# Altium project EVB-ANNA-B5x5_Certifi.PrjPcb (part 1 of 2)
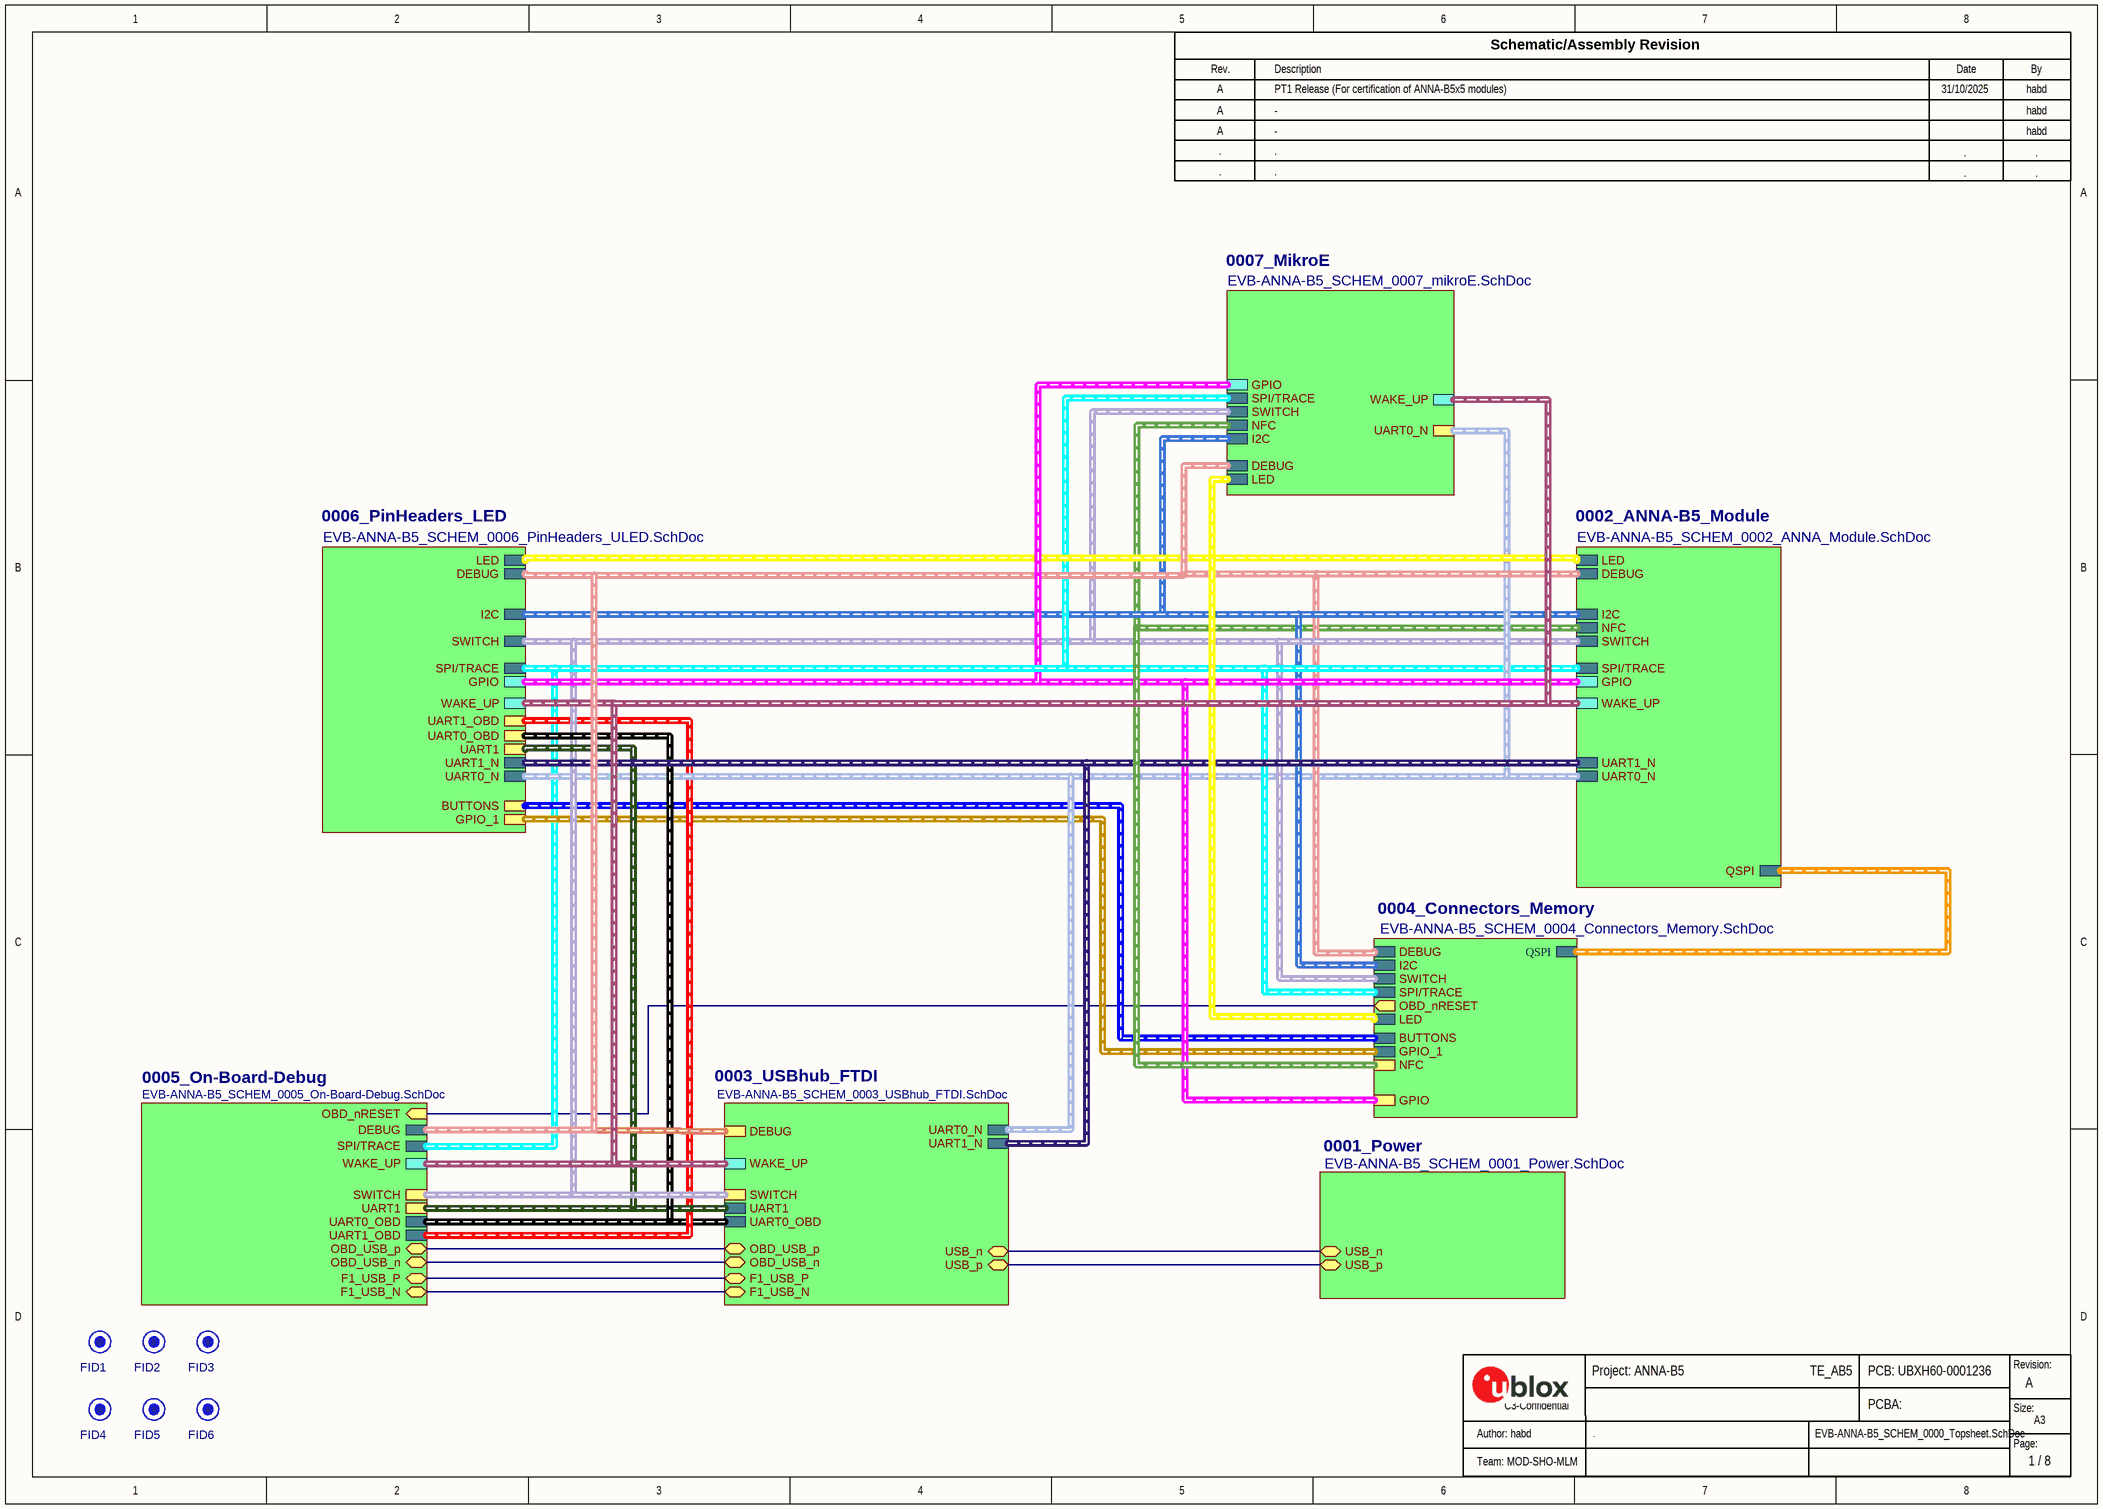
[diagram p0: EVB-ANNA-B5_SCHEM_0000_Topsheet.SchDoc]
GlobalClientName: u-blox; GlobalProjectCode: TE_AB5; GlobalProjectLink: www.u-blox.com; GlobalProjectName: ANNA-B5; GlobalProjectRevision: Rev A; GlobalProjectTeam: MOD-SHO-MLM; GlobalReleaseDate: 31/10/2025; PCBConfidentialGrade: C3-Confidential; PCBDocNum: UBXH60-0001236; PCBName: EVK-ANNA-B5x5; PCBRevRelease1: A; PCBRevReleaseBy1: habd; PCBRevReleaseBy2: -; PCBRevReleaseBy3: -; PCBRevReleaseBy4: -; PCBRevReleaseBy5: -; PCBRevReleaseDate1: 31/10/2025; PCBRevReleaseDate4: -; PCBRevReleaseDate5: -; PCBRevReleaseDesc1: PT1 Release (For certification of ANNA-B5x5 modules); PCBRevReleaseDesc2: -; PCBRevReleaseDesc3: -; PCBRevReleaseDesc4: -; PCBRevReleaseDesc5: -; PCBRevReleaseRev1: A; PCBRevReleaseRev2: -; PCBRevReleaseRev3: -; PCBRevReleaseRev4: -; PCBRevReleaseRev5: -; PCBUBXNum: UBXH60-0001236; ProjectEngineer: habd; ReleaseBy4: .; ReleaseBy4: .; ReleaseBy5: .; ReleaseBy5: .; ReleaseDate4: .; ReleaseDate5: .; ReleaseDesc4: .; ReleaseDesc5: .; ReleaseRev1: A; ReleaseRev2: -; ReleaseRev3: -; ReleaseRev4: .; ReleaseRev5: .; SchDocNum: EVK-ANNA-B5_SCHEM; SchSheetTotal: 8; SheetSize: A3; VariantBy1: habd; VariantBy2: habd; VariantBy3: habd; VariantBy4: .; VariantBy5: .; VariantDate1: 31/10/2025; VariantDate4: .; VariantDate5: .; VariantDesc1: PT1 Release (For certification of ANNA-B5x5 modules); VariantDesc2: -; VariantDesc3: -; VariantDesc4: .; VariantDesc5: .; VariantDescription: .; VariantRev: A; VariantRev1: A; VariantRev2: A; VariantRev3: A; VariantRev4: .; VariantRev5: .
5 sheets, 211 parts. Net scope: flat (ports and power ports of the same name join across sheets).
Board file: EVB-ANNA-B5x5_Certifi.PcbDoc
Sheets:
  EVB-ANNA-B5_SCHEM_0000_Topsheet.SchDoc
    0001_Power = EVB-ANNA-B5_SCHEM_0001_Power.SchDoc
    0002_ANNA-B5_Module = EVB-ANNA-B5_SCHEM_0002_ANNA_Module.SchDoc
    0003_USBhub_FTDI = EVB-ANNA-B5_SCHEM_0003_USBhub_FTDI.SchDoc
    0004_Connectors_Memory = EVB-ANNA-B5_SCHEM_0004_Connectors_Memory.SchDoc

## Sheet EVB-ANNA-B5_SCHEM_0000_Topsheet.SchDoc
size A3; Date: 7/24/2020; CompanyName: U-Blox; DrawnBy: EMOO; Engineer: EMOO; Organization: U-Blox; Address1: 3950 Fairview Industrial Dr SE #100; Address2: Salem, OR 97302; DocumentNumber: 1; SheetNumber: 1; SheetTotal: 8; SheetSize: B; SheetTitle: TopSheet

### Parts
FID1  FID  [FIDUCIAL40]  (value not drawn)  (no BOM)
FID2  FID  [FIDUCIAL40]  (value not drawn)  (no BOM)
FID3  FID  [FIDUCIAL40]  (value not drawn)  (no BOM)
FID4  FID  [FIDUCIAL40]  (value not drawn)  (no BOM)
FID5  FID  [FIDUCIAL40]  (value not drawn)  (no BOM)
FID6  FID  [FIDUCIAL40]  (value not drawn)  (no BOM)

### Sub-sheets
0001_Power = EVB-ANNA-B5_SCHEM_0001_Power.SchDoc: USB_n (bidir), USB_p (bidir)
0002_ANNA-B5_Module = EVB-ANNA-B5_SCHEM_0002_ANNA_Module.SchDoc: LED (harness LED), DEBUG (harness DEBUG), UART1_N (harness UART1_N), I2C (harness I2C), NFC (harness NFC), SWITCH (harness SWITCH), UART0_N (harness UART0_N), QSPI (harness QSPI), SPI/TRACE (harness SPI/TRACE), GPIO (harness GPIO), WAKE_UP (harness WAKE_UP)
0003_USBhub_FTDI = EVB-ANNA-B5_SCHEM_0003_USBhub_FTDI.SchDoc: USB_n (bidir), USB_p (bidir), F1_USB_P (bidir), F1_USB_N (bidir), UART1 (harness UART1), UART0_N (harness UART0_N), UART1_N (harness UART1_N), UART0_OBD (harness UART0_OBD), DEBUG (harness DEBUG), OBD_USB_n (bidir), OBD_USB_p (bidir), SWITCH (harness SWITCH), WAKE_UP (harness WAKE_UP)
0004_Connectors_Memory = EVB-ANNA-B5_SCHEM_0004_Connectors_Memory.SchDoc: DEBUG (harness DEBUG), I2C (harness I2C), SWITCH (harness SWITCH), QSPI (harness QSPI), SPI/TRACE (harness SPI/TRACE), LED (harness LED), BUTTONS (harness BUTTONS), GPIO_1 (harness GP1O_1), OBD_nRESET (out), NFC (harness NFC), GPIO (harness GPIO)
0005_On-Board-Debug = EVB-ANNA-B5_SCHEM_0005_On-Board-Debug.SchDoc (file not in this document): F1_USB_P (bidir), F1_USB_N (bidir), UART0_OBD (harness UART0_OBD), UART1_OBD (harness UART1_OBD), DEBUG (harness DEBUG), SPI/TRACE (harness SPI/TRACE), OBD_nRESET (in), OBD_USB_p (bidir), OBD_USB_n (bidir), UART1 (harness UART1), SWITCH (harness SWITCH), WAKE_UP (harness WAKE_UP)
0006_PinHeaders_LED = EVB-ANNA-B5_SCHEM_0006_PinHeaders_ULED.SchDoc (file not in this document): I2C (harness I2C), LED (harness LED), SWITCH (harness SWITCH), SPI/TRACE (harness SPI/TRACE), GPIO (harness GPIO), DEBUG (harness DEBUG), UART0_N (harness UART0_N), UART1_N (harness UART1_N), BUTTONS (harness BUTTONS), GPIO_1 (harness GP1O_1), UART1 (harness UART1), UART0_OBD (harness UART0_OBD), UART1_OBD (harness UART1_OBD), WAKE_UP (harness WAKE_UP)
0007_MikroE = EVB-ANNA-B5_SCHEM_0007_mikroE.SchDoc (file not in this document): I2C (harness I2C), LED (harness LED), SWITCH (harness SWITCH), NFC (harness NFC), DEBUG (harness DEBUG), SPI/TRACE (harness SPI/TRACE), GPIO (harness GPIO), UART0_N (harness UART0_N), WAKE_UP (harness WAKE_UP)

### Nets
(unnamed): sheet 0001_Power/USB_n, sheet 0003_USBhub_FTDI/USB_n
(unnamed): sheet 0001_Power/USB_p, sheet 0003_USBhub_FTDI/USB_p
(unnamed): sheet 0003_USBhub_FTDI/F1_USB_P, sheet 0005_On-Board-Debug/F1_USB_P
(unnamed): sheet 0003_USBhub_FTDI/F1_USB_N, sheet 0005_On-Board-Debug/F1_USB_N
(unnamed): sheet 0003_USBhub_FTDI/OBD_USB_n, sheet 0005_On-Board-Debug/OBD_USB_n
(unnamed): sheet 0003_USBhub_FTDI/OBD_USB_p, sheet 0005_On-Board-Debug/OBD_USB_p
(unnamed): sheet 0005_On-Board-Debug/OBD_nRESET, sheet 0004_Connectors_Memory/OBD_nRESET

### Buses and harness runs
harness sheet 0002_ANNA-B5_Module/DEBUG = sheet 0003_USBhub_FTDI/DEBUG = sheet 0004_Connectors_Memory/DEBUG = sheet 0005_On-Board-Debug/DEBUG = sheet 0006_PinHeaders_LED/DEBUG = sheet 0007_MikroE/DEBUG
harness sheet 0002_ANNA-B5_Module/GPIO = sheet 0004_Connectors_Memory/GPIO = sheet 0006_PinHeaders_LED/GPIO = sheet 0007_MikroE/GPIO
harness sheet 0002_ANNA-B5_Module/I2C = sheet 0004_Connectors_Memory/I2C = sheet 0006_PinHeaders_LED/I2C = sheet 0007_MikroE/I2C
harness sheet 0002_ANNA-B5_Module/LED = sheet 0004_Connectors_Memory/LED = sheet 0006_PinHeaders_LED/LED = sheet 0007_MikroE/LED
harness sheet 0002_ANNA-B5_Module/NFC = sheet 0004_Connectors_Memory/NFC = sheet 0007_MikroE/NFC
harness sheet 0002_ANNA-B5_Module/QSPI = sheet 0004_Connectors_Memory/QSPI
harness sheet 0002_ANNA-B5_Module/SPI/TRACE = sheet 0004_Connectors_Memory/SPI/TRACE = sheet 0005_On-Board-Debug/SPI/TRACE = sheet 0006_PinHeaders_LED/SPI/TRACE = sheet 0007_MikroE/SPI/TRACE
harness sheet 0002_ANNA-B5_Module/SWITCH = sheet 0003_USBhub_FTDI/SWITCH = sheet 0004_Connectors_Memory/SWITCH = sheet 0005_On-Board-Debug/SWITCH = sheet 0006_PinHeaders_LED/SWITCH = sheet 0007_MikroE/SWITCH
harness sheet 0002_ANNA-B5_Module/UART0_N = sheet 0003_USBhub_FTDI/UART0_N = sheet 0006_PinHeaders_LED/UART0_N = sheet 0007_MikroE/UART0_N
harness sheet 0002_ANNA-B5_Module/UART1_N = sheet 0003_USBhub_FTDI/UART1_N = sheet 0006_PinHeaders_LED/UART1_N
harness sheet 0002_ANNA-B5_Module/WAKE_UP = sheet 0003_USBhub_FTDI/WAKE_UP = sheet 0005_On-Board-Debug/WAKE_UP = sheet 0006_PinHeaders_LED/WAKE_UP = sheet 0007_MikroE/WAKE_UP
harness sheet 0003_USBhub_FTDI/UART0_OBD = sheet 0005_On-Board-Debug/UART0_OBD = sheet 0006_PinHeaders_LED/UART0_OBD
harness sheet 0003_USBhub_FTDI/UART1 = sheet 0005_On-Board-Debug/UART1 = sheet 0006_PinHeaders_LED/UART1
harness sheet 0004_Connectors_Memory/BUTTONS = sheet 0006_PinHeaders_LED/BUTTONS
harness sheet 0004_Connectors_Memory/GPIO_1 = sheet 0006_PinHeaders_LED/GPIO_1
harness sheet 0005_On-Board-Debug/UART1_OBD = sheet 0006_PinHeaders_LED/UART1_OBD

### Notes on the sheet
- Rev.
- Description
- Schematic/Assembly Revision
- Date
- By
- Revision:
- C3-Confidential
- Page:
- Size:
- A3

### Library data of the parts
FID1-FID6 = FIDUCIAL.04: Fiducial, 0.040" inner Dia, 0.075" outer Dia; Added By: Jeremy D; Part Number: FIDUCIAL.04; Size: 0.040"; Height: 0; DNP: DNP; Added Date: 2/1/2015; Checked By: Paul B; Checked Date: 2/5/2015

## Sheet EVB-ANNA-B5_SCHEM_0001_Power.SchDoc
size A3; Date: 7/24/2020; CompanyName: U-blox; DrawnBy: EMOO; Engineer: EMOO; Organization: U-blox; Address1: 3950 Fairview Industrial Dr SE #100; Address2: Salem, OR 97302; DocumentNumber: 2; SheetNumber: 2; SheetTotal: 8; SheetSize: B; SheetTitle: Power
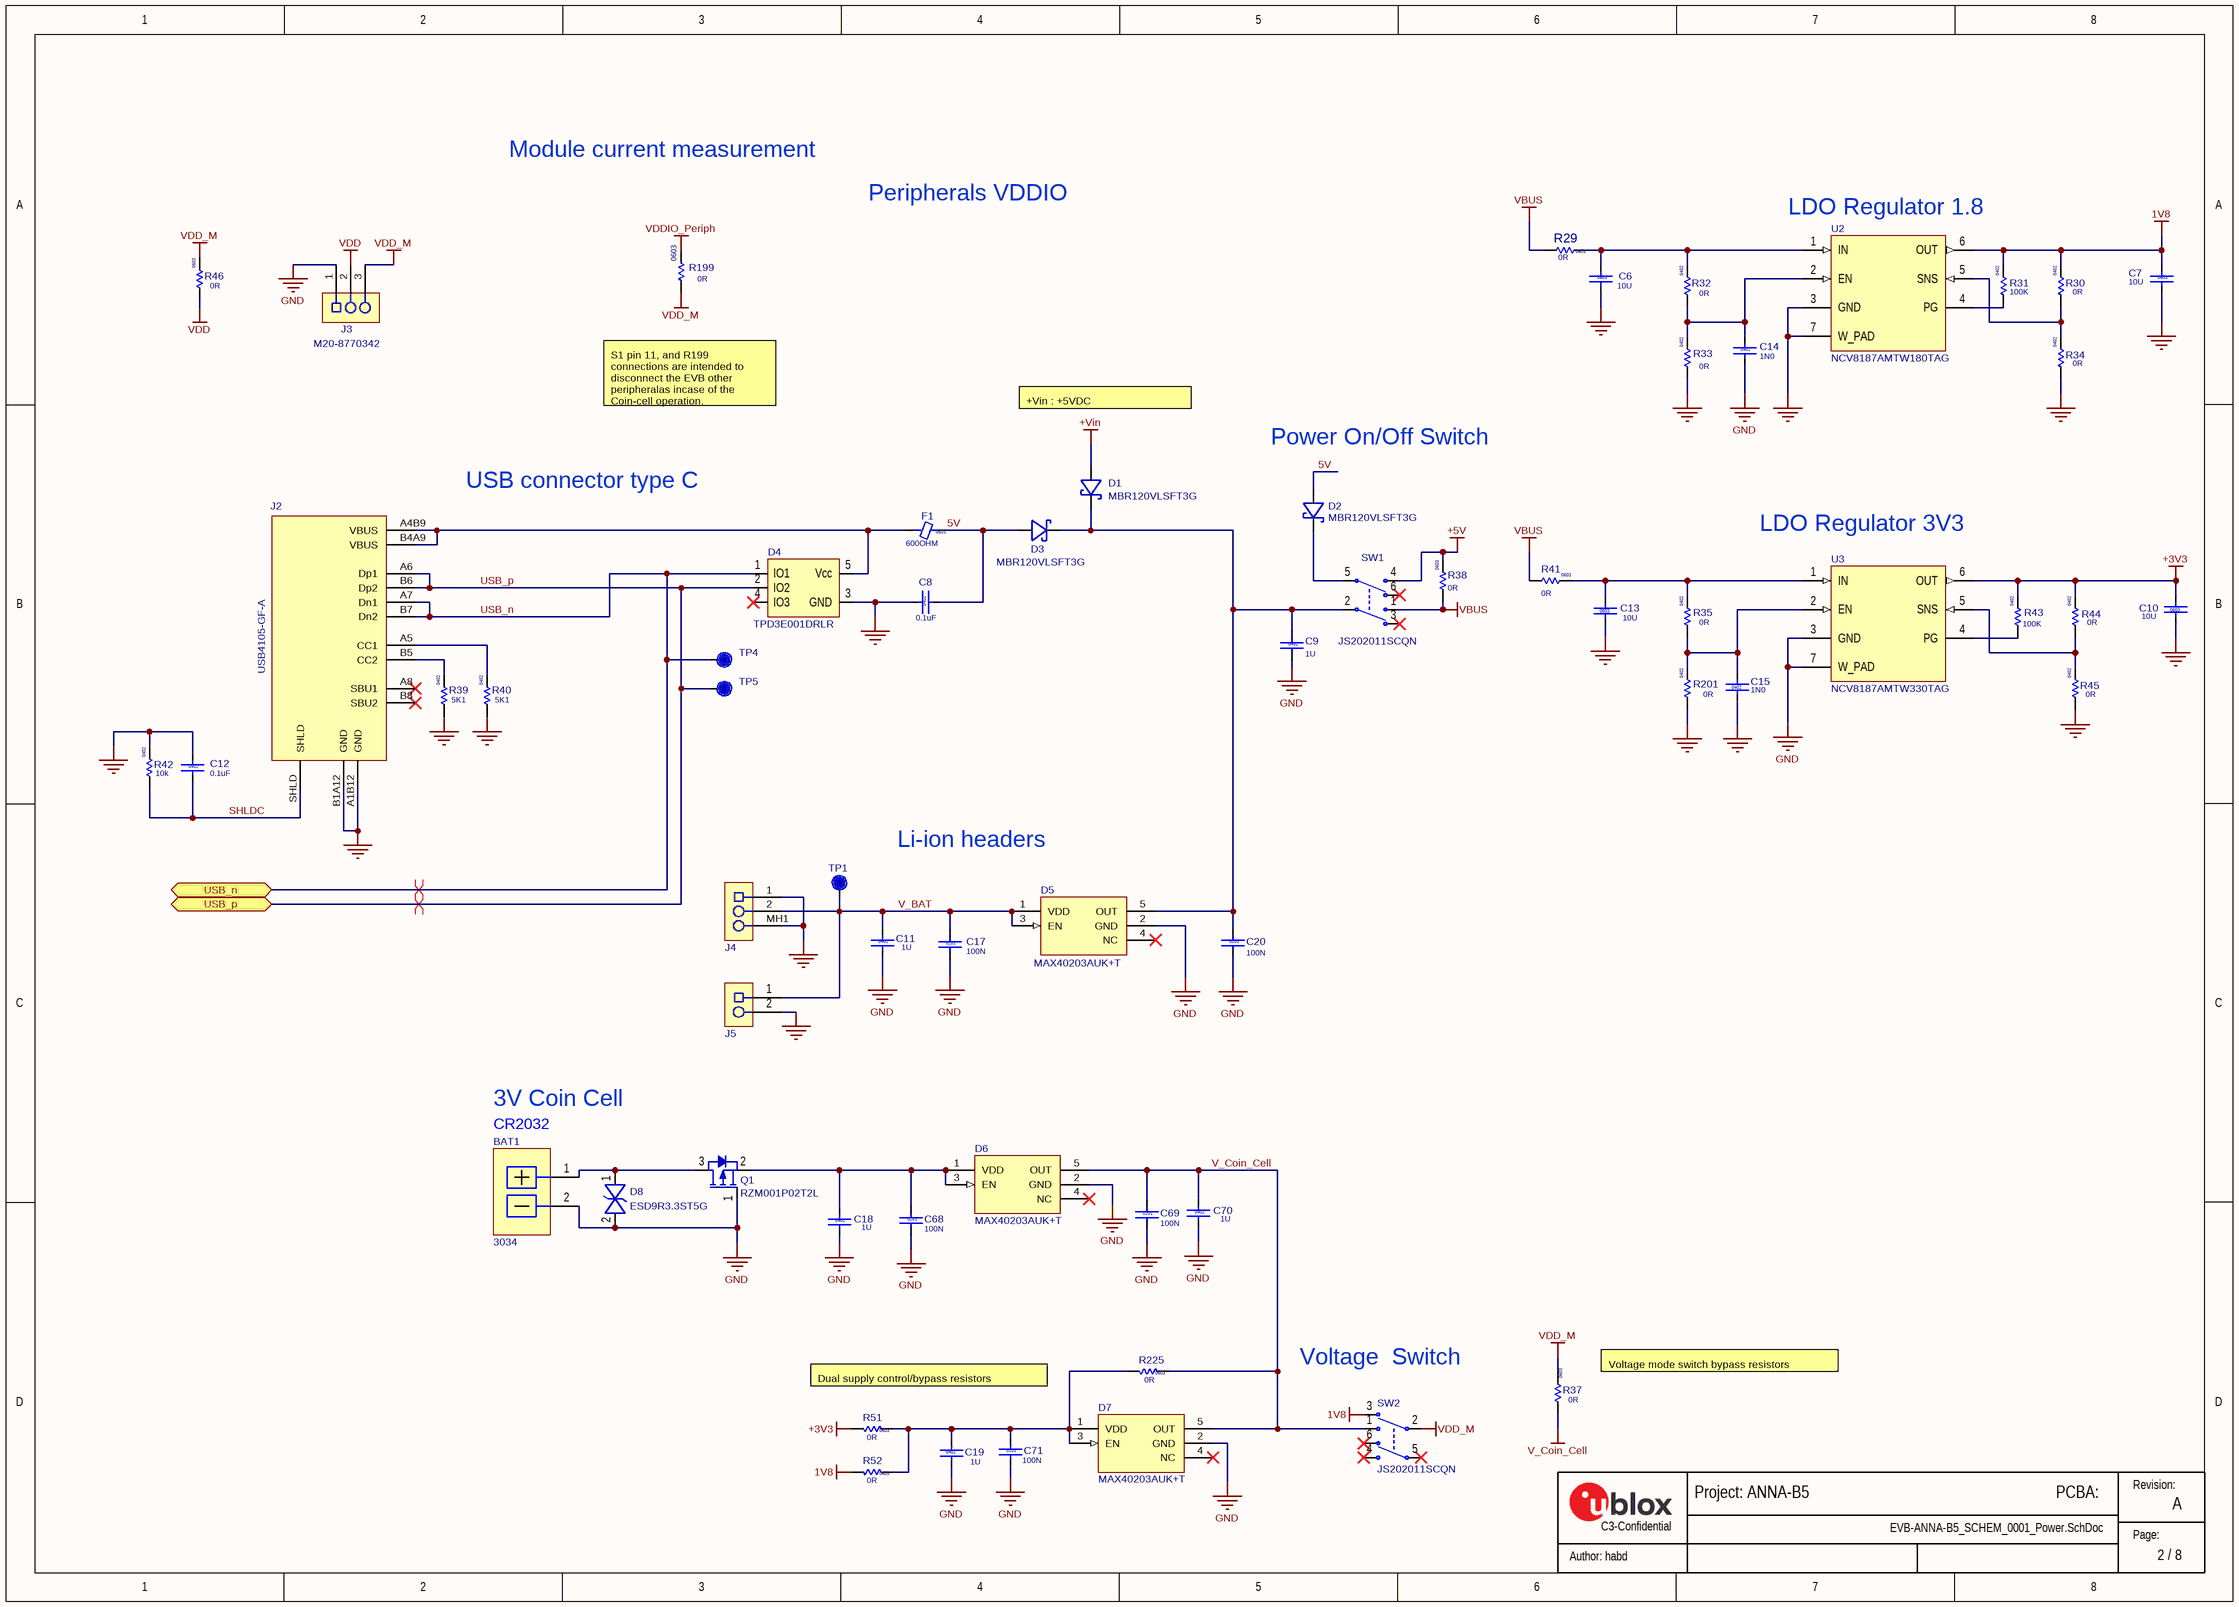
[diagram p1: EVB-ANNA-B5_SCHEM_0001_Power.SchDoc]

### Parts
BAT1  UBXH03-0000009  [3034]  (value not drawn)
C6  value 10U  Size: 0603  [CAP_0603_1750Lx950Wx850H_600x1000Pad_900G_FLX]  (hidden comment: UBXH01-0000310)
C7  value 10U  Size: 0603  [CAP_0603_1750Lx950Wx850H_600x1000Pad_900G_FLX]  (hidden comment: UBXH01-0000310)
C8  value 0.1uF  Size: 0402  [Cap 0402 HD]  (hidden comment: 120-00016)
C9  value 1U  Size: 0402  [Cap 0402 HD]  (hidden comment: UBXH01-0000248)
C10  value 10U  Size: 0603  [CAP_0603_1750Lx950Wx850H_600x1000Pad_900G_FLX]  (hidden comment: UBXH01-0000310)
C11  value 1U  Size: 0402  [Cap 0402 HD]  (hidden comment: UBXH01-0000248)
C12  value 0.1uF  Size: 0402  [Cap 0402 HD]  (hidden comment: 120-00016)
C13  value 10U  Size: 0603  [CAP_0603_1750Lx950Wx850H_600x1000Pad_900G_FLX]  (hidden comment: UBXH01-0000310)
C14  value 1N0  Size: 0402  [Cap 0402 HD]  (hidden comment: UBXH01-0000013)
C15  value 1N0  Size: 0402  [Cap 0402 HD]  (hidden comment: UBXH01-0000013)
C17  value 100N  Case/Package: 0201  [Cap 0201 HD]  (hidden comment: CAP CER X5R 0201 100N 10% 25V)
C18  value 1U  Size: 0402  [Cap 0402 HD]  (hidden comment: UBXH01-0000248)
C19  value 1U  Size: 0402  [Cap 0402 HD]  (hidden comment: UBXH01-0000248)
C20  value 100N  Case/Package: 0201  [Cap 0201 HD]  (hidden comment: CAP CER X5R 0201 100N 10% 25V)
C68  value 100N  Case/Package: 0201  [Cap 0201 HD]  (hidden comment: CAP CER X5R 0201 100N 10% 25V)
C69  value 100N  Case/Package: 0201  [Cap 0201 HD]  (hidden comment: CAP CER X5R 0201 100N 10% 25V)
C70  value 1U  Size: 0402  [Cap 0402 HD]  (hidden comment: UBXH01-0000248)
C71  value 100N  Case/Package: 0201  [Cap 0201 HD]  (hidden comment: CAP CER X5R 0201 100N 10% 25V)
D1  Manufacturer Part Number 1: MBR120VLSFT3G  [SOD-123F_U]  (hidden comment: 110-00005)
D2  Manufacturer Part Number 1: MBR120VLSFT3G  [SOD-123F_U]  (hidden comment: 110-00005)
D3  Manufacturer Part Number 1: MBR120VLSFT3G  [SOD-123F_U]  (hidden comment: 110-00005)
D4  Manufacturer P/N: TPD3E001DRLR  [SOT-553]  (hidden comment: 110-00018)
D5  Manufacturer Part Number 1: MAX40203AUK+T  [SOT-23-5_2]  (hidden comment: UBXH12-0000539)
D6  Manufacturer Part Number 1: MAX40203AUK+T  [SOT-23-5_2]  (hidden comment: UBXH12-0000539)
D7  Manufacturer Part Number 1: MAX40203AUK+T  [SOT-23-5_2]  (hidden comment: UBXH12-0000539)
D8  Manufacturer P/N: ESD9R3.3ST5G  [SOD-923]  (hidden comment: UBXH07-0000034)
F1  value 600OHM  Size: 0603  [IND_0603_1750Lx950Wx1050H_600x800Pad_800G_FLX]  (hidden comment: UBXH08-0000001)
J2  value USB4105-GF-A  [USB4105-GF-A]  (hidden comment: UBXH04-0000785)
J3  Manufacturer P/N: M20-8770342  [HDR-0.1P-3Pin-1Row-SMT]  (hidden comment: UBXH04-0000792)
J4  UBXH04-0000791  [B2B-PH-SM4-TB]  (value not drawn)
J5  UBXH04-0000026  [HDR-0.1P-2PIN-TH]  (value not drawn)
Q1  Manufacturer Part Number 1: RZM001P02T2L  [SOT-723]  (hidden comment: 140-00005)
R29  value 0R  Size: 0603  [RES_0603_1700Lx950Wx600H_600x1000Pad_800G_FLX]  (hidden comment: UBXH18-0003001)
R30  value 0R  Size: 0402  [RES 0402 HD]  (hidden comment: UBXH18-0003002)
R31  value 100K  Size: 0402  [RES 0402 HD]  (hidden comment: UBXH18-0000005)
R32  value 0R  Size: 0402  [RES 0402 HD]  (hidden comment: UBXH18-0003002)
R33  value 0R  Size: 0402  [RES 0402 HD]  (hidden comment: UBXH18-0003002)
R34  value 0R  Size: 0402  [RES 0402 HD]  (hidden comment: UBXH18-0003002)
R35  value 0R  Size: 0402  [RES 0402 HD]  (hidden comment: UBXH18-0003002)
R37  value 0R  Size: 0603  [RES_0603_1700Lx950Wx600H_600x1000Pad_800G_FLX]  (hidden comment: UBXH18-0003001)
R38  value 0R  Size: 0603  [RES_0603_1700Lx950Wx600H_600x1000Pad_800G_FLX]  (hidden comment: UBXH18-0003001)
R39  value 5K1  Size: 0402  [RES 0402 HD]  (hidden comment: UBXH18-0008066)
R40  value 5K1  Size: 0402  [RES 0402 HD]  (hidden comment: UBXH18-0008066)
R41  value 0R  Size: 0603  [RES_0603_1700Lx950Wx600H_600x1000Pad_800G_FLX]  (hidden comment: UBXH18-0003001)
R42  value 10k  Size: 0402  [RES 0402 HD]  (hidden comment: 180-00024)
R43  value 100K  Size: 0402  [RES 0402 HD]  (hidden comment: UBXH18-0000005)
R44  value 0R  Size: 0402  [RES 0402 HD]  (hidden comment: UBXH18-0003002)
R45  value 0R  Size: 0402  [RES 0402 HD]  (hidden comment: UBXH18-0003002)
R46  value 0R  Size: 0603  [RES_0603_1700Lx950Wx600H_600x1000Pad_800G_FLX]  (hidden comment: UBXH18-0003001)
R51  value 0R  Size: 0603  [RES_0603_1700Lx950Wx600H_600x1000Pad_800G_FLX]  (hidden comment: UBXH18-0003001)
R52  value 0R  Size: 0603  [RES_0603_1700Lx950Wx600H_600x1000Pad_800G_FLX]  (hidden comment: UBXH18-0003001)
R199  value 0R  Size: 0603  [RES_0603_1700Lx950Wx600H_600x1000Pad_800G_FLX]  (hidden comment: UBXH18-0003001)
R201  value 0R  Size: 0402  [RES 0402 HD]  (hidden comment: UBXH18-0003002)
R225  value 0R  Size: 0603  [RES_0603_1700Lx950Wx600H_600x1000Pad_800G_FLX]  (hidden comment: UBXH18-0003001)
SW1  Manufacturer P/N: JS202011SCQN  [SW_Slide_DPDT_JS202011SCQN]  (hidden comment: UBXH19-0000050)
SW2  Manufacturer P/N: JS202011SCQN  [SW_Slide_DPDT_JS202011SCQN]  (hidden comment: UBXH19-0000050)
TP1  TP10R  [TP10R]  (value not drawn)
TP4  TP10R  [TP10R]  (value not drawn)  (no BOM)
TP5  TP10R  [TP10R]  (value not drawn)  (no BOM)
U2  Manufacturer Part Number 1: NCV8187AMTW180TAG  [DFN0.65P-6Pin_W-Pad]  (hidden comment: UBXH43-0000004)
U3  Manufacturer Part Number 1: NCV8187AMTW330TAG  [DFN0.65P-6Pin_W-Pad]  (hidden comment: UBXH43-0000003)

### Ports
USB_n (bidir), USB_p (bidir)

### Nets
1V8: C7.1 R30.2 R31.2 R52.2 SW2.3(N.C-1) U2.6(OUT)
+3V3: C10.1 R43.2 R44.2 R51.2 U3.6(OUT)
+5V: R38.2 SW1.4(N.O-2)
+Vin: D1.A(Anode)
GND: BAT1.2 C6.2 C7.2 C8.1 C9.2 C10.2 C11.2 C12.1 C13.2 C14.2 C15.1 C17.2 C18.2 C19.2 C20.2 C68.2 C69.2 C70.2 C71.2 D4.3(GND) D5.2(GND) D6.2(GND) D7.2(GND) D8.2 J2.A1B12(GND) J2.B1A12(GND) J3.1 J4.1 J4.MH1 J5.2 Q1.1(G) R33.1 R34.1 R39.1 R40.1 R42.2 R45.1 R201.1 U2.3(GND) U2.7(W_PAD) U3.3(GND) U3.7(W_PAD)
V_Coin_Cell: C69.1 C70.1 D6.5(OUT) D7.5(OUT) R37.2 R225.1 SW2.1(N.O-1)
VBUS: R29.1 R38.1 R41.1 SW1.1(N.O-1)
VDD: J3.2 R46.1
VDD_M: J3.3 R37.1 R46.2 R199.1 SW2.2(COM-1)
VDDIO_Periph: R199.2
5V: C8.2 D2.A(Anode) D3.A(Anode) F1.2
SHLDC: C12.2 J2.SHLD R42.1
USB_n: D4.1(IO1) J2.A7(Dn1) J2.B7(Dn2) TP4.1 ; port USB_n
USB_p: D4.2(IO2) J2.A6(Dp1) J2.B6(Dp2) TP5.1 ; port USB_p
V_BAT: C11.1 C17.1 D5.1(VDD) D5.3(EN) J4.2 J5.1 TP1.1
NetBAT1_1: BAT1.1 D8.1 Q1.3(D)
NetC6_1: C6.1 R29.2 R32.2 U2.1(IN)
NetC9_1: C9.1 C20.1 D1.C(Cathode) D3.C(Cathode) D5.5(OUT) SW1.2(COM-1)
NetC13_1: C13.1 R35.2 R41.2 U3.1(IN)
NetC14_1: C14.1 R32.1 R33.2 U2.2(EN)
NetC15_2: C15.2 R35.1 R201.2 U3.2(EN)
NetC18_1: C18.1 C68.1 D6.1(VDD) D6.3(EN) Q1.2(S)
NetC19_1: C19.1 C71.1 D7.1(VDD) D7.3(EN) R51.1 R52.1 R225.2
NetD2_C: D2.C(Cathode) SW1.5(COM-2)
NetD4_5: D4.5(Vcc) F1.1 J2.A4B9(VBUS) J2.B4A9(VBUS)
NetJ2_A5: J2.A5(CC1) R40.2
NetJ2_B5: J2.B5(CC2) R39.2
NetR30_1: R30.1 R34.2 U2.5(SNS)
NetR31_1: R31.1 U2.4(PG)
NetR43_1: R43.1 U3.4(PG)
NetR44_1: R44.1 R45.2 U3.5(SNS)

Not connected (* = marked no-connect by the designer): D4 4(IO3)*; D5 4(NC)*; D6 4(NC)*; D7 4(NC)*; J2 A8(SBU1)* B8(SBU2)*; SW1 3(N.C-1)* 6(N.C-2)*; SW2 4(N.O-2)* 5(COM-2)* 6(N.C-2)*

### Layout directives
differential pair: USB_n, USB_p

### Notes on the sheet
- Module current measurement
- (near R199) Peripherals VDDIO
- (near U2) LDO Regulator 1.8
- S1 pin 11, and R199 connections are intended to disconnect the EVB other peripheralas incase of the Coin-cell operation.
- +Vin : +5VDC
- (near D2) Power On/Off Switch
- (near J2) USB connector type C
- (near U3) LDO Regulator 3V3
- Li-ion headers
- 3V Coin Cell
- (near BAT1) CR2032
- Dual supply control/bypass resistors
- (near SW2) Voltage  Switch
- (near R37) Voltage mode switch bypass resistors
- Revision:
- C3-Confidential
- Page:

### Library data of the parts
BAT1 = UBXH03-0000009: BATTERY HOLDER COIN SMT CR2020 CR2025 CR2032 KEYSTONE 3034; Manufacturer: Keystone Electronics Corporation; Value: 3034; Editor: eric.moog; Env: ROHS; Permitted Use: Support Products; Perferred: PREF; Mfg P/N Status: Active; Mfg P/N Split: 100; Mfg P/N Released: No; Manufacturer P/N: 3034; Part Number: UBXH03-0000009; Min Operating Temp: -55°C; Max Operating Temp: 125°C; Part Type: Battery; UBX Wiki: https://wiki.u-blox.com/bin/view/Operations/PartDetails?index=38836; RefDes: BT; Mfg P/N Datasheet: https://wiki.u-blox.com/bin/view/Generic/Docs/DocumentSummary?index=38835
C6 C7 C10 C13 = UBXH01-0000310: CAP CER X7R 0603 10U 20% 10V; Manufacturer: Murata Manufacturing Company, Ltd.; Manufacturer P/N: GRM188Z71A106MA73; Editor: michael.hein; Released by: martin.grasse; Env: ROHS; Permitted Use: Volume Products; Perferred: PREF; Mfg P/N Status: Active; Mfg P/N Split: 100; Mfg P/N Released: Yes; Part Number: UBXH01-0000310; Tolerance: 20%; Max Voltage: 10V; Min Operating Temp: -55°C; Max Operating Temp: 125°C; Part Type: Capacitor; Release Data: 2017-02-09T11:14:05; UBX Wiki: https://wiki.u-blox.com/bin/view/Operations/PartDetails?index=26280; RefDes: C; Mfg P/N Datasheet: https://wiki.u-blox.com/bin/view/Generic/Docs/DocumentSummary?index=26282; Manufacturer 2: Murata Manufacturing Company, Ltd.; Manufacturer P/N 2: GRM188Z71A106KA73; Mfg P/N Status 2: Active; Mfg P/N Split 2: 0; Mfg P/N Released 2: Yes; Mfg P/N Datasheet 2: https://wiki.u-blox.com/bin/view/Generic/Docs/DocumentSummary?index=28416
  C10 C13: Case/Package: 0x0y
C8 C12 = 120-00016: Cap, Ceramic 0.1uF 10V 10% X5R 0402; Part Name: CAP CER 0.1UF 10V 10% X5R 0402; Part_Type: Ceramic Capacitor; Manufacturer: Murata Electronics North America; Manufacturer P/N: GRM155R61A104KA01J; Item_Phase: Production; Component Mounting Type: SMT; Tolerance: +/- 10%; Use in new designs: Yes; Part Number: 120-00016; Revision: 0A; Supplier 1: Digi-Key; Supplier Part Number 1: 490-6297-1-ND; Manufacturer 2: Yageo; Manufacturer P/N 2: CC0402KRX5R6BB104; Supplier 2: Digi-Key; Supplier Part Number 2: 311-1336-1-ND; Arena Link: https://app.bom.com/a/GYHPV2L2L43KRMBK?v=spec.summary; Height: 0.55mm; Pins: 2; Temperature Coefficient: X5R; Voltage: 10V
C9 C11 C18 C19 C70 = UBXH01-0000248: CAP CER X5R 0402 1U 10% 10V; Manufacturer: Murata Manufacturing Company, Ltd.; Manufacturer P/N: GRM155R61C105KA12; Editor: michael.hein; Released by: igor.shevchenko; Env: ROHS; Permitted Use: Volume Products; Perferred: PREF; Mfg P/N Status: Active; Mfg P/N Split: 100; Mfg P/N Released: Yes; Part Number: UBXH01-0000248; Tolerance: 10%; Max Voltage: 10V; Min Operating Temp: -40°C; Max Operating Temp: 85°C; Part Type: Capacitor; Release Data: 2016-03-16T11:26:35; UBX Wiki: https://wiki.u-blox.com/bin/view/Operations/PartDetails?index=24378; RefDes: C; Mfg P/N Datasheet: https://wiki.u-blox.com/bin/view/Generic/Docs/DocumentSummary?index=29581; Manufacturer 2: TDK Corporation; Manufacturer P/N 2: C1005X5R1E105K050BC; Mfg P/N Status 2: Active; Mfg P/N Split 2: 0; Mfg P/N Released 2: Yes; Mfg P/N Datasheet 2: https://wiki.u-blox.com/bin/view/Generic/Docs/DocumentSummary?index=28058; Manufacturer 3: Samsung Electro-Mechanics; Manufacturer P/N 3: CL05A105KA5NQNC; Mfg P/N Status 3: Active; Mfg P/N Split 3: 0; Mfg P/N Released 3: Yes; Mfg P/N Datasheet 3: https://wiki.u-blox.com/bin/view/Generic/Docs/DocumentSummary?index=28056
  C19: Case/Package: 0x0y
C14 C15 = UBXH01-0000013: CAP CER X7R 0402 1N0 10% 50V; Manufacturer: Murata Manufacturing Company, Ltd.; Manufacturer P/N: GRM155R71H102KA01; Editor: massimo.vlacci; Released by: dario.antonaz; Env: ROHS; Permitted Use: Volume Products; Perferred: PREF; Mfg P/N Status: NRND; Mfg P/N Split: 100; Mfg P/N Released: Yes; Part Number: UBXH01-0000013; Tolerance: 10%; Max Voltage: 50V; Part Type: Capacitor; Release Data: 2015-04-23T14:26:43; UBX Wiki: https://wiki.u-blox.com/bin/view/Operations/PartDetails?index=8466; RefDes: C; Mfg P/N Datasheet: https://wiki.u-blox.com/bin/view/Generic/Docs/DocumentSummary?index=22572; Case/Package: 0x0y
C17 C20 C68 C69 C71 = UBXCMP-CAP-00178-4: Critical Part: No; Part Number: UBXH01-0000241; PLM Revision: A; Component Mounting Type: SMT; Owner: Dario Antonaz (null); Pack Type: DEFAULT; Volume Use: Yes; Environmental Grade: RoHS; PLM Lifecycle Phase: Full Production; JEDEC Type: S0201_C; Max Operating Temperature: 85°C; Tolerance: 10%; Part: CAP; Temperature Coefficient: X5R; Maximum Voltage: 25V; Use in new designs: Yes; Min Operating Temperature: -40°C; Part Status: Preferred; Automotive: No
D1-D3 = 110-00005: Diode, Schottky, 20V 1A SOD-123F, 340mV Vf @ 1A / MBR120VLSFT3G; Manufacturer 1: ON Semiconductor; Part Name: Diode Schottky 20V 1A SOD-123FL; Body Size: None; Item Phase: In Production; MFG Package: SOD-123FL; Use in new designs: Yes; Part Number: 110-00005; Supplier 1: Digi-Key; Supplier Part Number 1: MBR120VLSFT3GOSCT-ND; Manufacturer 2: None; Manufacturer Part Number 2: None; Supplier 2: None; Supplier Part Number 2: None; Current: 1A; Height: 0.98mm; Max Operating Temp: 125; Min Operating Temp: -65; Pins: 2; Revision: 0B; Voltage: 20V; UBX Code: None
D4 = 110-00018: LOW-CAPACITANCE 3-CHANNEL ESD-PROTECTION ARRAY; Part Name: TVS Diode, 3CH High Speed ESD; Part_Type: Diode; Manufacturer: Texas Instruments; Item_Phase: Production; Body Size: 1.6mm x 1.2mm; Component Mounting Type: SMT; Diode Type: TVS; Use in new designs: Yes; Voltage: 5V; Part Number: 110-00018; Revision: 0A; Supplier 1: Digi-Key; Supplier Part Number 1: 296-21885-1-ND; Arena Link: https://app.bom.com/a/UCV39GZGZIHX50AE?v=spec.summary; Height: .55mm; MFG Package: SOT-553; Package Type: SOT; Pins: 5
D5-D7 = UBXH12-0000539: IDEAL DIODE OR CONTROLLER SOURCE SELECTOR SWITCH P-CHANNEL 1:1 SOT-23-5 5.5V 1A; Part Name: IC IDEAL DIODE LDO 1.2-5.5V 1.0A SOT-23-5; Manufacturer 1: Maxim; Item_Phase: Preliminary; Body Size: 2.8mm x 2.9mm; Component Mounting Type: SMT; Current: 1.0A; SMT Pitch: 0.95mm; Use in new designs: Yes; Value: MAX40203AUK+T; Editor: eric.moog; Env: ROHS; Permitted Use: Support Products; Mfg P/N Status: Active; Mfg P/N Split: 100; Mfg P/N Released: No; Part Number: UBXH12-0000539; Part_Type: Ideal Diode; Supplier 1: Digi-Key; Supplier Part Number 1: 175-MAX40203AUK+TTR-ND; Height: 1.25; MFG Package: SOT-23-5; Package Type: SOT-23-5; Pins: 5; Voltage: 5.5V; HelpURL: https://datasheets.maximintegrated.com/en/ds/MAX40203.pdf; Max Voltage: 5.5V; Max Current: 1A; Part Type: PMIC; UBX Wiki: https://wiki.u-blox.com/bin/view/Operations/PartDetails?index=38597; Perferred: N/A; RefDes: U; Manufacturer: Maxim; Manufacturer P/N: MAX40203AUK+T; Mfg P/N Datasheet: https://wiki.u-blox.com/bin/view/Generic/Docs/DocumentSummary?index=38598
D8 = UBXH07-0000034: ESD PROTECTION DIODE ULTRA LOW LEAKAGE SOD923 ON SEMI 3V3; Manufacturer: ON Semiconductor; Editor: pierpaolo.arban; Released by: dario.antonaz; Env: ROHS; Permitted Use: Support Products; Perferred: PREF; Mfg P/N Status: Active; Mfg P/N Split: 100; Mfg P/N Released: Yes; Part Number: UBXH07-0000034; Value: 3V3; Part Type: Diode; Release Data: 2015-04-23T14:51:11; UBX Wiki: https://wiki.u-blox.com/bin/view/Operations/PartDetails?index=22447; RefDes: D; Mfg P/N Datasheet: https://wiki.u-blox.com/bin/view/Generic/Docs/DocumentSummary?index=22449
F1 = UBXH08-0000001: FERRITE BEAD 0603 600 OHM AT 100MHZ 600OHM 500mA; Manufacturer: TDK Corporation; Manufacturer P/N: MMZ1608B601C; Editor: daniel.hurni; Released by: martin.frauchiger; Env: ROHS; Permitted Use: Support Products; Perferred: PREF; Mfg P/N Status: Active; Mfg P/N Split: 100; Mfg P/N Released: Yes; Part Number: UBXH08-0000001; Max Current: 500mA; Min Operating Temp: -40°C; Max Operating Temp: 125°C; Part Type: Ferrite; Release Data: 2009-12-02T10:18:36; UBX Wiki: https://wiki.u-blox.com/bin/view/Operations/PartDetails?index=7960; RefDes: FB; Mfg P/N Datasheet: https://wiki.u-blox.com/bin/view/Generic/Docs/DocumentSummary?index=7941
J2 = UBXH04-0000785: CONN RCP USB2.0 TYP C 24P SMD RA 20V 6.25A; Manufacturer 1: GCT; Body Size: 7.3mm x 8.9mm; Item Phase: Unreleased; SMT Pitch: 0.5mm; Use in new designs: Yes; Voltage: <20V DC; UBX Code: None; Editor: eric.moog; Env: ROHS; Permitted Use: Support Products; Perferred: PREF; Mfg P/N Status: Active; Mfg P/N Split: 100; Mfg P/N Released: No; Part Number: UBXH04-0000785; Manufacturer Part Number 1: USB4105-GF-A; Height: 3.31mm; Max Operating Temp: 85°C; Min Operating Temp: -40°C; Pins: 8; Revision: None; Size: Other; Manufacturer 2: None; Manufacturer Part Number 2: None; Supplier 2: None; Supplier Part Number 2: None; Max Voltage: 20V; Max Current: 6.25A; Part Type: Connector; UBX Wiki: https://wiki.u-blox.com/bin/view/Operations/PartDetails?index=38207; RefDes: J; Manufacturer: GCT; Manufacturer P/N: USB4105-GF-A; Mfg P/N Datasheet: https://wiki.u-blox.com/bin/view/Generic/Docs/DocumentSummary?index=38208
J3 = UBXH04-0000792: 1-ROW SMD CONN 100MIL GRID 3 -PIN 100V 3A; Manufacturer: HARWiN; Value: M20-8770342; Editor: eric.moog; Env: ROHS; Permitted Use: Support Products; Mfg P/N Status: Active; Mfg P/N Split: 100; Mfg P/N Released: No; Part Number: UBXH04-0000792; Max Voltage: 100V; Max Current: 3A; Min Operating Temp: -40°C; Max Operating Temp: 105°C; Part Type: Connector; UBX Wiki: https://wiki.u-blox.com/bin/view/Operations/PartDetails?index=38569; Perferred: N/A; RefDes: J; Mfg P/N Datasheet: https://wiki.u-blox.com/bin/view/Generic/Docs/DocumentSummary?index=28457
J4 = UBXH04-0000791: CONN 1-ROW SMT 2.0MM GRID 2-PIN VERT 100V 2A; Part Name: Conn, SMT, 0.079" Pitch, 2 Pin, Vert, Black; Manufacturer: JST; Item Phase: In Production; Use in new designs: Yes; Voltage: None; Value: B2B-PH-SM4-TB; Editor: eric.moog; Env: ROHS; Permitted Use: Support Products; Mfg P/N Status: Active; Mfg P/N Split: 100; Mfg P/N Released: No; Part Number: UBXH04-0000791; Manufacturer Part Number 1: B2B-PH-SM4-TB; Supplier 1: None; Supplier Part Number 1: None; Diameter: None; Height: 6.5mm; Max Operating Temp: 85°C; Min Operating Temp: -30°C; Pins: 2; Revision: 0A; UBX Code: None; Manufacturer 2: None; Manufacturer Part Number 2: None; Supplier 2: None; Supplier Part Number 2: None; Manufacturer P/N: B2B-PH-SM4-TB; Max Voltage: 100V; Max Current: 2A; Part Type: Connector; UBX Wiki: https://wiki.u-blox.com/bin/view/Operations/PartDetails?index=38567; Perferred: N/A; RefDes: J; Mfg P/N Datasheet: https://wiki.u-blox.com/bin/view/Generic/Docs/DocumentSummary?index=35463
J5 = UBXH04-0000026: 1-ROW TH-PCB SOCKETS 100MIL GRID 2-PIN 0.64MM SQUARE POLARIZE; Manufacturer P/N: M20-9990245; Manufacturer: HARWiN; Value: M20-9990245; Editor: roland.rust; Released by: alvaro.nussbaum; Env: ROHS; Permitted Use: Internal Use; Perferred: PREF; Mfg P/N Status: Active; Mfg P/N Split: 100; Mfg P/N Released: Yes; Part Number: UBXH04-0000026; Part Type: Connector; Release Data: 2015-06-04T16:45:09; UBX Wiki: https://wiki.u-blox.com/bin/view/Operations/PartDetails?index=10937; RefDes: J
Q1 = 140-00005: P-MOSFET, 20V, 100mA, SOT-723-3; Part Name: MOSFET P-CH 20V 0.1A VMT3; Manufacturer 1: Rohm Semiconductor; Body Size: 1.2mm x 0.8mm; Transistor Type: P-Channel; Use in new designs: Yes; Item Phase: In Production; Thermal Pad: No; UBX Code: None; Part Number: 140-00005; Current: 100mA; Height: 0.5mm; MFG Package: SOT-723; Pins: 3; Voltage: 20V; Max Operating Temp: 150; Min Operating Temp: -55; Revision: 0B; Manufacturer 2: Toshiba Semiconductor and Storage; Supplier 1: Digi-Key; Supplier Part Number 1: RZM001P02T2LCT-ND; Manufacturer Part Number 2: SSM3J35MFV,L3F; Supplier 2: Digi-Key; Supplier Part Number 2: SSM3J35MFVL3FCT-ND
R29 R37 R38 R41 R46 R51 R52 R199 R225 = UBXH18-0003001: RES THICK FILM CHIP 0603 0R 0 100mW; Manufacturer: YAGEO; Manufacturer P/N: RC0603JR-070RL; Tolerance: 0; Editor: martin.frauchiger; Env: ROHS; Permitted Use: Volume Products; Perferred: PREF; Mfg P/N Status: Active; Mfg P/N Split: 100; Mfg P/N Released: Yes; Part Number: UBXH18-0003001; Max Power: 100mW; Part Type: Resistor; Released by: martin.frauchiger; Release Data: 2005-07-14T10:55:51; UBX Wiki: https://wiki.u-blox.com/bin/view/Operations/PartDetails?index=6609; RefDes: R
  R199: Case/Package: 0x0y
R30 R32 R44 R45 R201 = UBXH18-0003002: RES THICK FILM CHIP 0402 0R 0 100mW; Manufacturer: KOA; Manufacturer P/N: RK73Z1ETTP; Tolerance: 0; Editor: charlotte.biber; Released by: peter.mueller; Env: ROHS; Permitted Use: Volume Products; Perferred: PREF; Mfg P/N Status: NRND; Mfg P/N Split: 100; Mfg P/N Released: Yes; Part Number: UBXH18-0003002; Max Power: 100mW; Part Type: Resistor; Release Data: 2012-06-05 09:49:55.978616; UBX Wiki: https://wiki.u-blox.com/bin/view/Operations/PartDetails?index=6611; RefDes: R; Manufacturer 2: YAGEO; Manufacturer P/N 2: 2322_705_91001_L; Mfg P/N Status 2: NRND; Mfg P/N Split 2: 0; Mfg P/N Released 2: Yes
R31 R43 = UBXH18-0000005: RES THICK FILM CHIP 0402 100K 1% 63mW; Manufacturer: KOA; Manufacturer P/N: RK73H1ETTP1003F; Editor: dario.antonaz; Released by: sandro.sestan; Env: ROHS; Permitted Use: Volume Products; Mfg P/N Status: Active; Mfg P/N Split: 100; Mfg P/N Released: Yes; Part Number: UBXH18-0000005; Tolerance: 1%; Max Power: 63mW; Part Type: Resistor; Release Data: 2009-11-30T11:05:22; UBX Wiki: https://wiki.u-blox.com/bin/view/Operations/PartDetails?index=8114; Perferred: N/A; RefDes: R; Mfg P/N Split 2: 0; Mfg P/N Released 2: Yes; Mfg P/N Datasheet: https://wiki.u-blox.com/bin/view/Generic/Docs/DocumentSummary?index=8222
  R31: Manufacturer 2: YAGEO; Manufacturer P/N 2: RC0402FR-07100KL; Mfg P/N Status 2: Active; Case/Package: 0x0y; Mfg P/N Datasheet 2: https://wiki.u-blox.com/bin/view/Generic/Docs/DocumentSummary?index=29373; Manufacturer 3: ROHM; Manufacturer P/N 3: MCR01MZPF1003; Mfg P/N Status 3: Obsolete; Mfg P/N Split 3: 0; Mfg P/N Released 3: Yes; Mfg P/N Datasheet 3: https://wiki.u-blox.com/bin/view/Generic/Docs/DocumentSummary?index=8186
  R43: Manufacturer 2: ROHM; Manufacturer P/N 2: MCR01MZPF1003; Mfg P/N Status 2: Obsolete; Mfg P/N Datasheet 2: https://wiki.u-blox.com/bin/view/Generic/Docs/DocumentSummary?index=8186
R33-R35 = UBXH18-0003002: RES THICK FILM CHIP 0402 0R 0 100mW; Manufacturer: KOA; Manufacturer P/N: RK73Z1ETTD; Tolerance: 0; Editor: charlotte.biber; Released by: peter.mueller; Env: ROHS; Permitted Use: Volume Products; Perferred: PREF; Mfg P/N Status: NRND; Mfg P/N Split: 100; Mfg P/N Released: Yes; Part Number: UBXH18-0003002; Max Power: 100mW; Part Type: Resistor; Release Data: 2012-06-05T09:49:55; UBX Wiki: https://wiki.u-blox.com/bin/view/Operations/PartDetails?index=6611; RefDes: R; Manufacturer 2: YAGEO; Manufacturer P/N 2: 2322_705_91001_L; Mfg P/N Status 2: Obsolete; Mfg P/N Split 2: 0; Mfg P/N Released 2: Yes
R39 R40 = UBXH18-0008066: RES THICK FILM CHIP 0402 5K1 5% 100mW; Manufacturer: Panasonic; Manufacturer P/N: ERJ-2GEJ512X; Editor: alvaro.nussbaum; Released by: roland.rust; Env: ROHS; Permitted Use: Internal Use; Perferred: NONPREF; Mfg P/N Status: Active; Mfg P/N Split: 100; Mfg P/N Released: No; Part Number: UBXH18-0008066; Tolerance: 5%; Max Power: 100mW; Part Type: Resistor; Release Data: 2016-02-11T15:22:01; UBX Wiki: https://wiki.u-blox.com/bin/view/Operations/PartDetails?index=6972; RefDes: R
R42 = 180-00024: Resistor 10k ohm 1% 1/16W, 0402; Part Name: RES SMD 10K OHM 1% 1/16W 0402; Manufacturer 1: Samsung Electro-Mechanics America, Inc; Manufacturer Part Number 1: RC1005F103CS; Tolerance: +/- 1%; Use in new designs: Yes; Item Phase: In Production; UBX Code: None; Part Number: 180-00024; Revision: 0E; Supplier 1: Digi-Key; Supplier Part Number 1: 1276-3431-1-ND; Manufacturer 2: Hong Kong Resistors Manufactory; Height: 0.4mm; Pins: 2; Power: 1/16W; Voltage: N/A; Manufacturer Part Number 2: RCT0210KFLF; Supplier 2: None; Supplier Part Number 2: None; Max Operating Temp: 155; Min Operating Temp: -55
SW1 SW2 = UBXH19-0000050: 2 WAY ON-ON SUB-MINIATURE SLIDE SWITCH SMD JS SERIES; Manufacturer: C&K Components; Value: JS202011SCQN; Editor: andre.pick; Released by: martin.pilik; Env: ROHS; Permitted Use: Support Products; Perferred: PREF; Mfg P/N Status: Active; Mfg P/N Split: 100; Mfg P/N Released: Yes; Part Number: UBXH19-0000050; Min Operating Temp: -40°C; Max Operating Temp: 85°C; Part Type: Switch; Release Data: 2022-06-09T16:59:15; UBX Wiki: https://wiki.u-blox.com/bin/view/Operations/PartDetails?index=36899; RefDes: S; Mfg P/N Datasheet: https://wiki.u-blox.com/bin/view/Generic/Docs/DocumentSummary?index=16625
TP1 TP4 TP5 = TP10R: Testpoint, Round 1.0mm Dia; Added By: Jeremy D; Part Number: TP10R; Size: 1.0mm; Height: 0; DNP: DNP; Checked By: Paul B
  TP1: Added Date: 2015-02-01; Checked Date: 2015-02-05
  TP4 TP5: Added Date: 2/1/2015; Checked Date: 2/5/2015
U2 = UBXH43-0000004: LDO REGULATOR 1.8V,LOW Iq, WDFNW6 2x2 MM PACKAGE 1200 mA; Manufacturer 1: ONSEMI Conductor; Manufacturer Split 1: 100; Part Phase: Unreleased; Environmental Grade: RoHS; Owner: Hozaifa Abdelgadir; Use in new designs: Yes; Volume Use: No; Maximum Current: 1.2A; Body Size: 2.10mm x 2.10 mm; Max Supply Voltage: 5.5V; Min Supply Voltage: 1.5; SMT Pitch: 0.65mm; Part Number: UBXH43-0000004; Automotive: No; ComponentLink1Description: Arena Link; ComponentLink1Url: https://app.bom.com/1J3MRFNPJL4CV8H3H3XG; Max Operating Temp: 150°C; Min Operating Temp: -40°C; Part Name: LDO REGULATOR 1.8V,LOW Iq, WDFNW6 2x2 MM PACKAGE 1200 mA; Part Status: Non-Preferred; Part Type: Regulator - Linear; Height: 0.8mm; Mounting Type: SMT; Output Voltage: 1.8V; Pins: 6; Single Source: No; Case/Package: WDFNW6 2x2; Thermal Pad: Yes
U3 = UBXH43-0000003: LDO REGULATOR 3.3V,LOW Iq, WDFNW6 2x2 MM, 0.65P PACKAGE 1200 mA; Manufacturer 1: ONSEMI Conductor; Manufacturer Split 1: 100; Part Name: LDO REGULATOR  3.3V,LOW Iq, WDFNW6 2x2 MM PACKAGE 1200 mA; Part Phase: Unreleased; Part Revision: 1; Environmental Grade: RoHS; Owner: Hozaifa Abdelgadir; Use in new designs: Yes; Volume Use: No; Maximum Current: 1.2A; Body Size: 2.1mmx2.1mm; Max Supply Voltage: 5.5V; Min Supply Voltage: 1.5V; SMT Pitch: 0.65mm; Part Number: UBXH43-0000003; Automotive: No; ComponentLink1Description: Arena Link; ComponentLink1Url: https://app.bom.com/R9TCH5DF9BU2LY72VT52; Max Operating Temp: 150°C; Min Operating Temp: -40°C; Part Status: Non-Preferred; Part Type: Regulator - Linear; Height: 0.8mm; Mounting Type: SMT; Output Voltage: 3.3V; Pins: 6; Single Source: No; Case/Package: WDFNW6 2x2; Thermal Pad: Yes

## Sheet EVB-ANNA-B5_SCHEM_0002_ANNA_Module.SchDoc: UBX_NORA_B1_SCHEM_0001_NORA_B1_Module
size A3; Date: 7/24/2020; CompanyName: U-blox; DrawnBy: EMOO; Engineer: EMOO; Organization: U-blox; Address1: 3950 Fairview Industrial Dr SE #100; Address2: Salem, OR 97302; DocumentNumber: 3; SheetNumber: 3; SheetTotal: 8; Website: www.u-blox.com; SheetSize: B
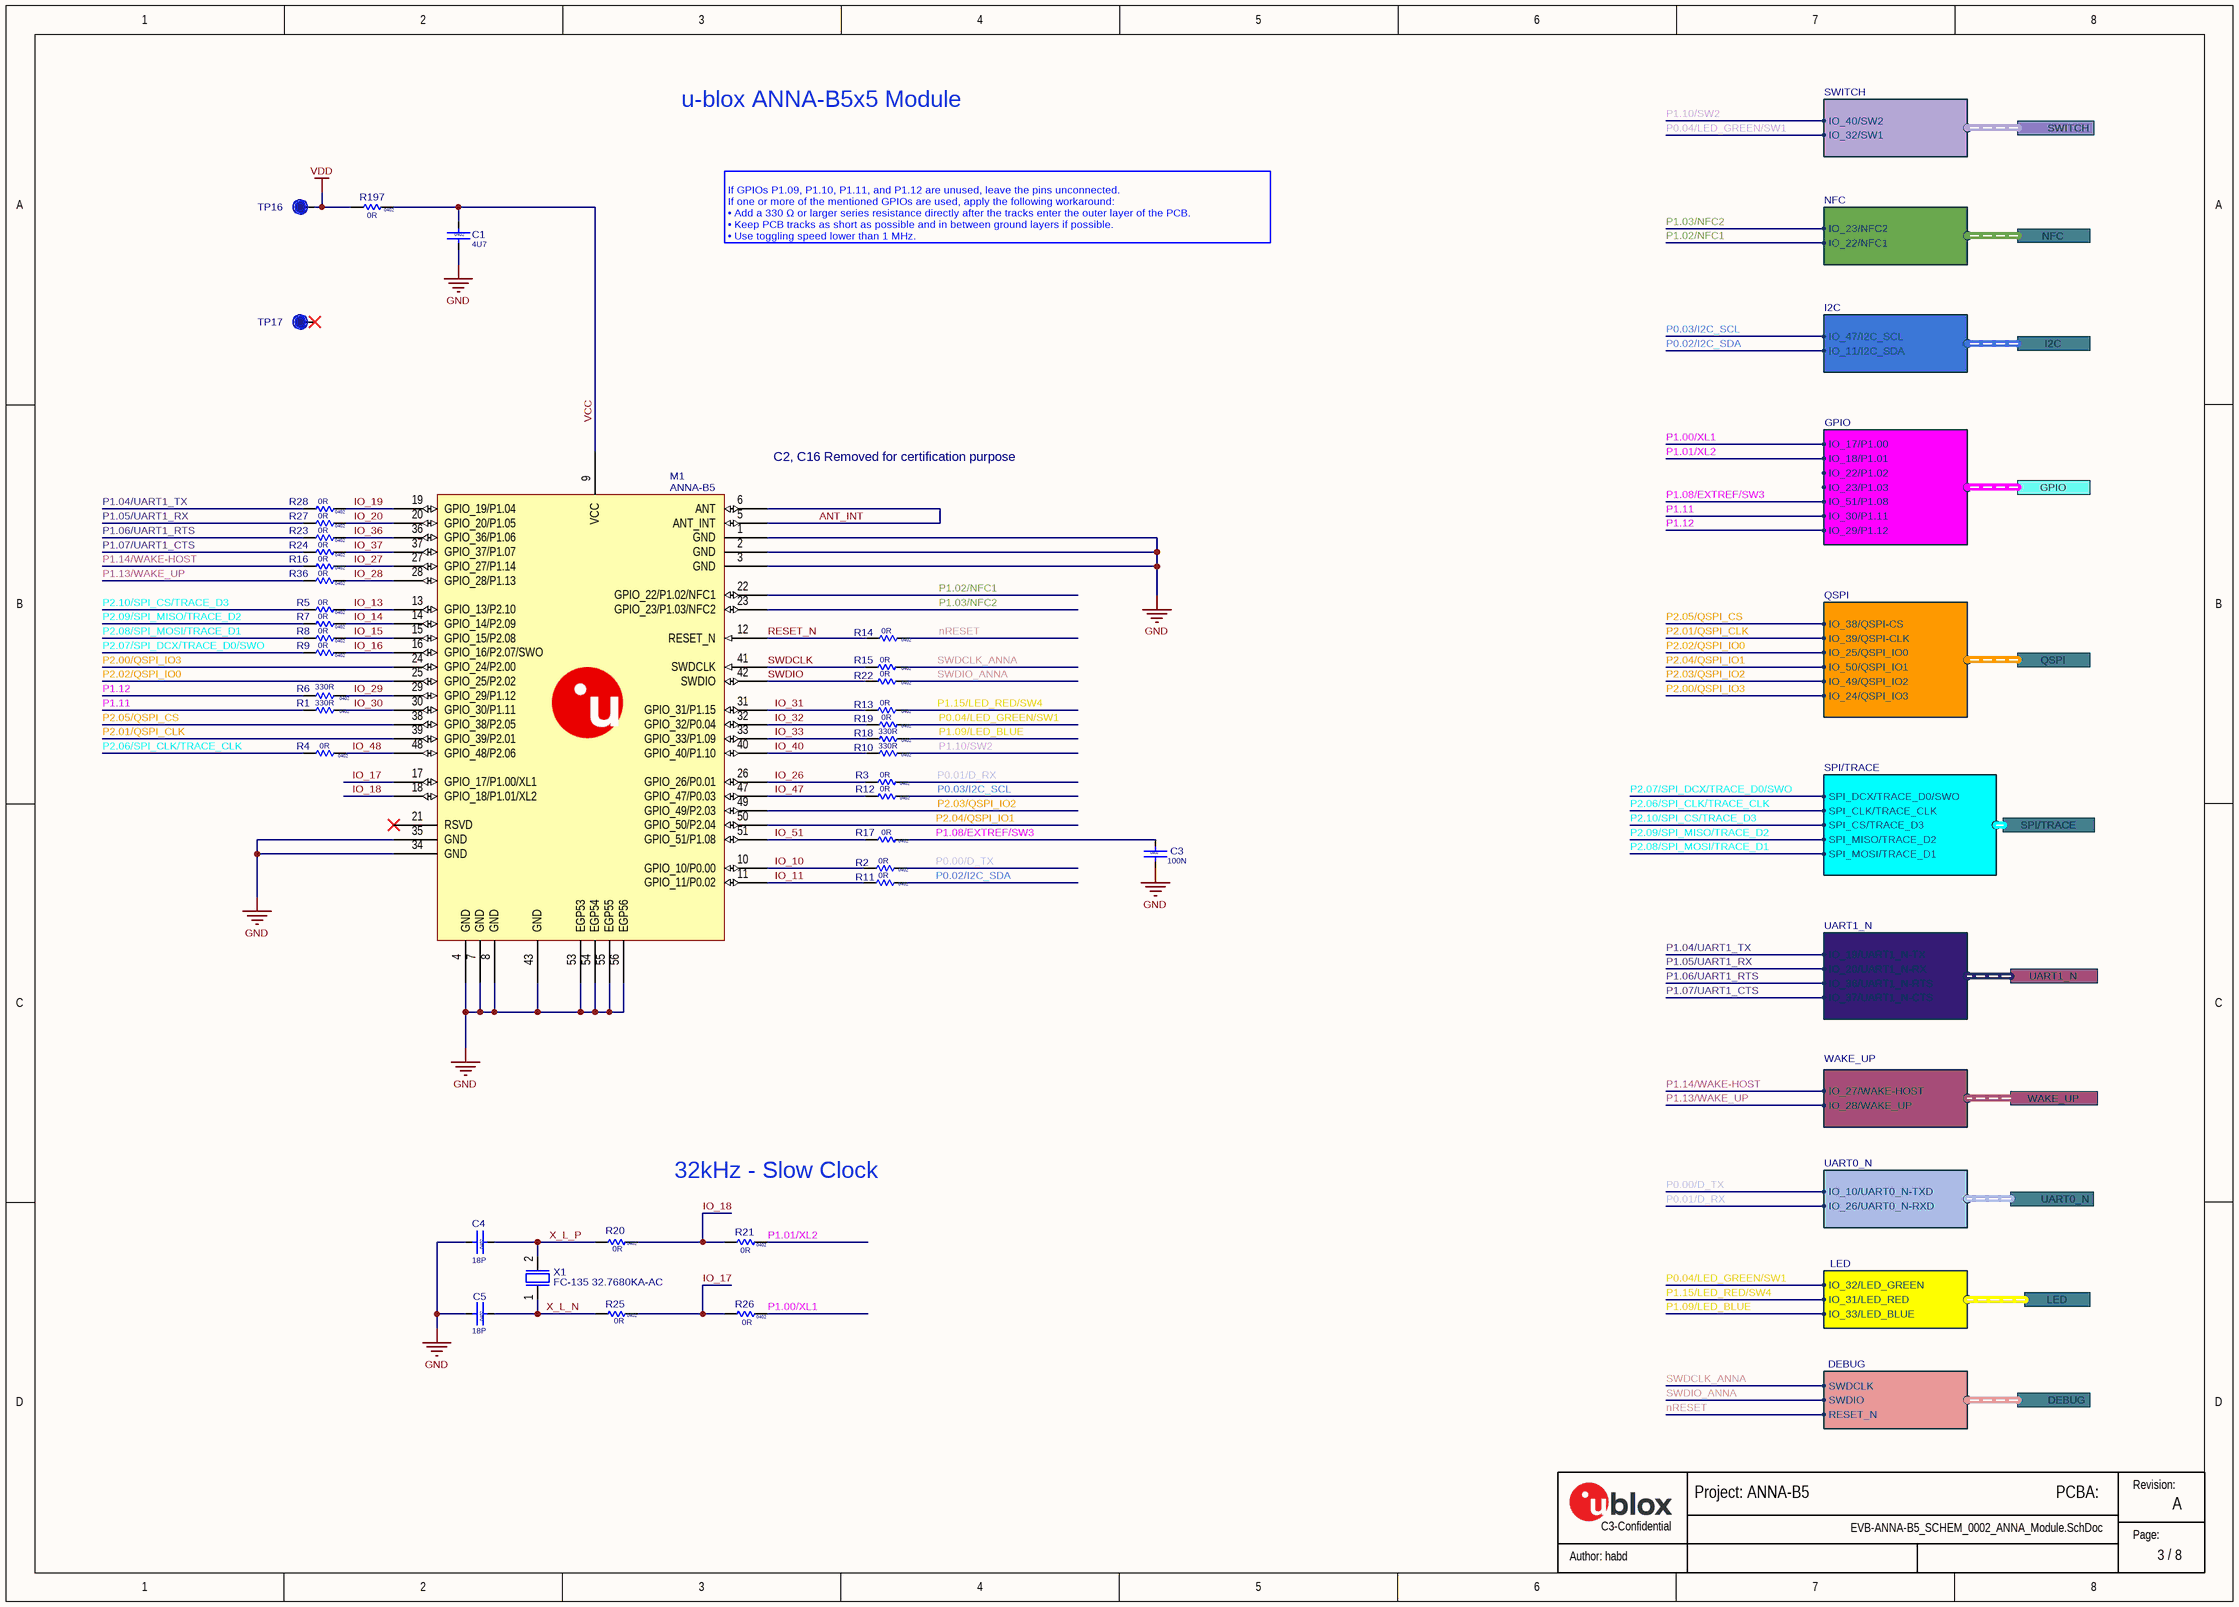
[diagram p2: EVB-ANNA-B5_SCHEM_0002_ANNA_Module.SchDoc]

### Parts
C1  value 4U7  Size: 0402  [Cap 0402 HD]  (hidden comment: UBXH01-0000243)
C3  value 100N  Size: 0402  [Cap 0402 HD]  (hidden comment: UBXH01-2021002)
C4  value 18P  Size: 0402  [Cap_0402_1100Lx600Wx600H_600x600Pad_350G_FLX]  (hidden comment: UBXH01-0004017)
C5  value 18P  Size: 0402  [Cap_0402_1100Lx600Wx600H_600x600Pad_350G_FLX]  (hidden comment: UBXH01-0004017)
M1  UBXH29-0000036  [ANNA-B5]  (value not drawn)
R1  value 330R  Size: 0402  [RES_0402_1100Lx600Wx400H_500x600Pad_400G_FLX]  (hidden comment: UBXH18-0008037)
R2  value 0R  Size: 0402  [RES 0402 HD]  (hidden comment: UBXH18-0003002)
R3  value 0R  Size: 0402  [RES 0402 HD]  (hidden comment: UBXH18-0003002)
R4  value 0R  Size: 0402  [RES 0402 HD]  (hidden comment: UBXH18-0003002)
R5  value 0R  Size: 0402  [RES 0402 HD]  (hidden comment: UBXH18-0003002)
R6  value 330R  Size: 0402  [RES_0402_1100Lx600Wx400H_500x600Pad_400G_FLX]  (hidden comment: UBXH18-0008037)
R7  value 0R  Size: 0402  [RES 0402 HD]  (hidden comment: UBXH18-0003002)
R8  value 0R  Size: 0402  [RES 0402 HD]  (hidden comment: UBXH18-0003002)
R9  value 0R  Size: 0402  [RES 0402 HD]  (hidden comment: UBXH18-0003002)
R10  value 330R  Size: 0402  [RES_0402_1100Lx600Wx400H_500x600Pad_400G_FLX]  (hidden comment: UBXH18-0008037)
R11  value 0R  Size: 0402  [RES 0402 HD]  (hidden comment: UBXH18-0003002)
R12  value 0R  Size: 0402  [RES_0402_1100Lx600Wx400H_500x600Pad_400G_FLX]  (hidden comment: UBXH18-0003002)
R13  value 0R  Size: 0402  [RES_0402_1100Lx600Wx400H_500x600Pad_400G_FLX]  (hidden comment: UBXH18-0003002)
R14  value 0R  Size: 0402  [RES_0402_1100Lx600Wx400H_500x600Pad_400G_FLX]  (hidden comment: UBXH18-0003002)
R15  value 0R  Size: 0402  [RES 0402 HD]  (hidden comment: UBXH18-0003002)
R16  value 0R  Size: 0402  [RES 0402 HD]  (hidden comment: UBXH18-0003002)
R17  value 0R  Size: 0402  [RES 0402 HD]  (hidden comment: UBXH18-0003002)
R18  value 330R  Size: 0402  [RES_0402_1100Lx600Wx400H_500x600Pad_400G_FLX]  (hidden comment: UBXH18-0008037)
R19  value 0R  Size: 0402  [RES 0402 HD]  (hidden comment: UBXH18-0003002)
R20  value 0R  Size: 0402  [RES 0402 HD]  (hidden comment: UBXH18-0003002)
R21  value 0R  Size: 0402  [RES_0402_1100Lx600Wx400H_500x600Pad_400G_FLX]  (hidden comment: UBXH18-0003002)
R22  value 0R  Size: 0402  [RES 0402 HD]  (hidden comment: UBXH18-0003002)
R23  value 0R  Size: 0402  [RES 0402 HD]  (hidden comment: UBXH18-0003002)
R24  value 0R  Size: 0402  [RES 0402 HD]  (hidden comment: UBXH18-0003002)
R25  value 0R  Size: 0402  [RES 0402 HD]  (hidden comment: UBXH18-0003002)
R26  value 0R  Size: 0402  [RES_0402_1100Lx600Wx400H_500x600Pad_400G_FLX]  (hidden comment: UBXH18-0003002)
R27  value 0R  Size: 0402  [RES 0402 HD]  (hidden comment: UBXH18-0003002)
R28  value 0R  Size: 0402  [RES 0402 HD]  (hidden comment: UBXH18-0003002)
R36  value 0R  Size: 0402  [RES_0402_1100Lx600Wx400H_500x600Pad_400G_FLX]  (hidden comment: UBXH18-0003002)
R197  value 0R  Size: 0402  [RES 0402 HD]  (hidden comment: UBXH18-0003002)
TP16  TP10R  [TP10R]  (value not drawn)  (no BOM)
TP17  TP10R  [TP10R]  (value not drawn)  (no BOM)
X1  Manufacturer P/N: FC-135 32.7680KA-AC  [XTAL_3215]  (hidden comment: UBXH21-0008104)

### Ports
DEBUG (harness Debug), GPIO (harness GPIO), I2C (harness I2C), LED (harness LED), NFC (harness NFC), QSPI (harness QSPI), SPI/TRACE (harness SPI/TRACE), SWITCH (harness SWITCH), UART0_N (harness UART0_N), UART1_N (harness UART1_N), WAKE_UP (harness WAKE_UP)

### Harnesses
DEBUG: RESET_N, SWDIO, SWDCLK
UART1_N: IO_36/UART1_N-RTS, IO_37/UART1_N-CTS, IO_19/UART1_N-TX, IO_20/UART1_N-RX
QSPI: IO_38/QSPI-CS, IO_39/QSPI-CLK, IO_25/QSPI_IO0, IO_50/QSPI_IO1, IO_49/QSPI_IO2, IO_24/QSPI_IO3
LED: IO_33/LED_BLUE, IO_31/LED_RED, IO_32/LED_GREEN
I2C: IO_47/I2C_SCL, IO_11/I2C_SDA
NFC: IO_23/NFC2, IO_22/NFC1
SWITCH: IO_40/SW2, IO_32/SW1
GPIO: IO_17/P1.00, IO_18/P1.01, IO_22/P1.02, IO_51/P1.08, IO_23/P1.03, IO_30/P1.11, IO_29/P1.12
UART0_N: IO_10/UART0_N-TXD, IO_26/UART0_N-RXD
WAKE_UP: IO_27/WAKE-HOST, IO_28/WAKE_UP
SPI/TRACE: SPI_DCX/TRACE_D0/SWO, SPI_CLK/TRACE_CLK, SPI_CS/TRACE_D3, SPI_MISO/TRACE_D2, SPI_MOSI/TRACE_D1

### Nets
GND: C1.2 C3.1 C4.2 C5.2 M1.1(GND) M1.2(GND) M1.3(GND) M1.4(GND) M1.7(GND) M1.8(GND) M1.34(GND) M1.35(GND) M1.43(GND) M1.53(EGP53) M1.54(EGP54) M1.55(EGP55) M1.56(EGP56)
VDD: R197.2 TP16.1
ANT_INT: M1.5(ANT_INT) M1.6(ANT)
IO_10: M1.10(GPIO_10/P0.00) R2.2
IO_11: M1.11(GPIO_11/P0.02) R11.1
IO_13: M1.13(GPIO_13/P2.10) R5.2
IO_14: M1.14(GPIO_14/P2.09) R7.2
IO_15: M1.15(GPIO_15/P2.08) R8.2
IO_16: M1.16(GPIO_16/P2.07/SWO) R9.2
IO_17: M1.17(GPIO_17/P1.00/XL1) R25.2 R26.2
IO_18: M1.18(GPIO_18/P1.01/XL2) R20.2 R21.2
IO_19: M1.19(GPIO_19/P1.04) R28.1
IO_20: M1.20(GPIO_20/P1.05) R27.1
IO_26: M1.26(GPIO_26/P0.01) R3.2
IO_27: M1.27(GPIO_27/P1.14) R16.2
IO_28: M1.28(GPIO_28/P1.13) R36.1
IO_29: M1.29(GPIO_29/P1.12) R6.2
IO_30: M1.30(GPIO_30/P1.11) R1.2
IO_31: M1.31(GPIO_31/P1.15) R13.1
IO_32: M1.32(GPIO_32/P0.04) R19.1
IO_33: M1.33(GPIO_33/P1.09) R18.2
IO_36: M1.36(GPIO_36/P1.06) R23.2
IO_37: M1.37(GPIO_37/P1.07) R24.2
IO_40: M1.40(GPIO_40/P1.10) R10.2
IO_47: M1.47(GPIO_47/P0.03) R12.1
IO_48: M1.48(GPIO_48/P2.06) R4.2
IO_51: M1.51(GPIO_51/P1.08) R17.2
nRESET: R14.2 ; port DEBUG.RESET_N
P0.00/D_TX: R2.1 ; port UART0_N.IO_10/UART0_N-TXD
P0.01/D_RX: R3.1 ; port UART0_N.IO_26/UART0_N-RXD
P0.02/I2C_SDA: R11.2 ; port I2C.IO_11/I2C_SDA
P0.03/I2C_SCL: R12.2 ; port I2C.IO_47/I2C_SCL
P0.04/LED_GREEN/SW1: R19.2 ; port LED.IO_32/LED_GREEN, port SWITCH.IO_32/SW1
P1.00/XL1: R26.1 ; port GPIO.IO_17/P1.00
P1.01/XL2: R21.1 ; port GPIO.IO_18/P1.01
P1.02/NFC1: M1.22(GPIO_22/P1.02/NFC1) ; port NFC.IO_22/NFC1
P1.03/NFC2: M1.23(GPIO_23/P1.03/NFC2) ; port NFC.IO_23/NFC2
P1.04/UART1_TX: R28.2 ; port UART1_N.IO_19/UART1_N-TX
P1.05/UART1_RX: R27.2 ; port UART1_N.IO_20/UART1_N-RX
P1.06/UART1_RTS: R23.1 ; port UART1_N.IO_36/UART1_N-RTS
P1.07/UART1_CTS: R24.1 ; port UART1_N.IO_37/UART1_N-CTS
P1.08/EXTREF/SW3: C3.2 R17.1 ; port GPIO.IO_51/P1.08
P1.09/LED_BLUE: R18.1 ; port LED.IO_33/LED_BLUE
P1.10/SW2: R10.1 ; port SWITCH.IO_40/SW2
P1.11: R1.1 ; port GPIO.IO_30/P1.11
P1.12: R6.1 ; port GPIO.IO_29/P1.12
P1.13/WAKE_UP: R36.2 ; port WAKE_UP.IO_28/WAKE_UP
P1.14/WAKE-HOST: R16.1 ; port WAKE_UP.IO_27/WAKE-HOST
P1.15/LED_RED/SW4: R13.2 ; port LED.IO_31/LED_RED
P2.00/QSPI_IO3: M1.24(GPIO_24/P2.00) ; port QSPI.IO_24/QSPI_IO3
P2.01/QSPI_CLK: M1.39(GPIO_39/P2.01) ; port QSPI.IO_39/QSPI-CLK
P2.02/QSPI_IO0: M1.25(GPIO_25/P2.02) ; port QSPI.IO_25/QSPI_IO0
P2.03/QSPI_IO2: M1.49(GPIO_49/P2.03) ; port QSPI.IO_49/QSPI_IO2
P2.04/QSPI_IO1: M1.50(GPIO_50/P2.04) ; port QSPI.IO_50/QSPI_IO1
P2.05/QSPI_CS: M1.38(GPIO_38/P2.05) ; port QSPI.IO_38/QSPI-CS
P2.06/SPI_CLK/TRACE_CLK: R4.1 ; port SPI/TRACE.SPI_CLK/TRACE_CLK
P2.07/SPI_DCX/TRACE_D0/SWO: R9.1 ; port SPI/TRACE.SPI_DCX/TRACE_D0/SWO
P2.08/SPI_MOSI/TRACE_D1: R8.1 ; port SPI/TRACE.SPI_MOSI/TRACE_D1
P2.09/SPI_MISO/TRACE_D2: R7.1 ; port SPI/TRACE.SPI_MISO/TRACE_D2
P2.10/SPI_CS/TRACE_D3: R5.1 ; port SPI/TRACE.SPI_CS/TRACE_D3
RESET_N: M1.12(RESET_N) R14.1
SWDCLK: M1.41(SWDCLK) R15.1
SWDCLK_ANNA: R15.2 ; port DEBUG.SWDCLK
SWDIO: M1.42(SWDIO) R22.1
SWDIO_ANNA: R22.2 ; port DEBUG.SWDIO
VCC: C1.1 M1.9(VCC) R197.1
X_L_N: C5.1 R25.1 X1.1
X_L_P: C4.1 R20.1 X1.2

Not connected (* = marked no-connect by the designer): M1 21(RSVD)*; TP17 1*

### Notes on the sheet
- u-blox ANNA-B5x5 Module
- If GPIOs P1.09, P1.10, P1.11, and P1.12 are unused, leave the pins unconnected.
  If one or more of the mentioned GPIOs are used, apply the following workaround:
  • Add a 330 Ω or larger series resistance directly after the tracks enter the outer layer of the PCB.
  • Keep PCB tracks as short as possible and in between ground layers if possible.
  • Use toggling speed lower than 1 MHz.
- (near M1) C2, C16 Removed for certification purpose
- 32kHz - Slow Clock
- Revision:
- C3-Confidential
- Page:

### Library data of the parts
C1 = UBXH01-0000243: CAP CER X5R 0402 4U7 20% 10V; Manufacturer: Murata Manufacturing Company, Ltd.; Manufacturer P/N: GRM155R61A475MEAA; Editor: martin.pilik; Released by: fabrice.bret-dibat; Env: GREEN; Permitted Use: Volume Products; Perferred: PREF; Mfg P/N Status: Active; Mfg P/N Split: 100; Mfg P/N Released: Yes; Part Number: UBXH01-0000243; Tolerance: 20%; Max Voltage: 10V; Min Operating Temp: -40°C; Max Operating Temp: 85°C; Part Type: Capacitor; Release Data: 2021-05-10 12:57:47.325652; UBX Wiki: https://wiki.u-blox.com/bin/view/Operations/PartDetails?index=24303; RefDes: C; Mfg P/N Datasheet: https://wiki.u-blox.com/bin/view/Generic/Docs/DocumentSummary?index=24302
C3 = UBXH01-2021002: CAP CER X5R 0402 100N 10% 10V; Manufacturer: Murata Manufacturing Company, Ltd.; Manufacturer P/N: GRM155R61A104KA01; Editor: roland.rust; Env: GREEN; Permitted Use: Volume Products; Perferred: PREF; Mfg P/N Status: NRND; Mfg P/N Split: 100; Mfg P/N Released: Yes; Part Number: UBXH01-2021002; Tolerance: 10%; Max Voltage: 10V; Part Type: Capacitor; Released by: roland.rust; Release Data: 2005-07-22T13:59:44; UBX Wiki: https://wiki.u-blox.com/bin/view/Operations/PartDetails?index=5759; RefDes: C; Manufacturer 2: Samsung Electro-Mechanics; Manufacturer P/N 2: CL05A104KP5NNN; Mfg P/N Status 2: Active; Mfg P/N Split 2: 0; Mfg P/N Released 2: Yes; Mfg P/N Datasheet 2: https://wiki.u-blox.com/bin/view/Generic/Docs/DocumentSummary?index=28113
C4 C5 = UBXH01-0004017: CAP CER C0G 0402 18P 5% 25V; Manufacturer: Murata Manufacturing Company, Ltd.; Manufacturer P/N: GRM1555C1H180JA01; Editor: doris.zahnd; Env: ROHS; Permitted Use: Volume Products; Perferred: PREF; Mfg P/N Status: NRND; Mfg P/N Split: 100; Mfg P/N Released: Yes; Released by: daniel.hurni; Part Number: UBXH01-0004017; Tolerance: 5%; Max Voltage: 25V; Min Operating Temp: -55°C; Max Operating Temp: 125°C; Part Type: Capacitor; UBX Wiki: https://wiki.u-blox.com/bin/view/Operations/PartDetails?index=5178; RefDes: C; Release Data: 2009-12-03T17:48:42; Manufacturer 2: Murata Manufacturing Company, Ltd.; Manufacturer P/N 2: GRM1555C1E180JZ01; Mfg P/N Status 2: Obsolete; Mfg P/N Split 2: 0; Mfg P/N Released 2: Yes; Manufacturer 3: Murata Manufacturing Company, Ltd.; Manufacturer P/N 3: GRM1555C1H180JZ01; Mfg P/N Status 3: Obsolete; Mfg P/N Split 3: 0; Mfg P/N Released 3: Yes
M1 = UBXH29-0000036: SHORT RANGE BLE AND IEEE802.15.4 SIP MODULE U-BLOX ANNA-B5; Part Description: SHORT RANGE BLE AND IEEE802.15.4 SIP U-BLOX ANNA-B5; Part Phase: Unreleased; Part Revision: 1; Environmental Grade: RoHS; Owner: Yaqin Chen; Use in new designs: Yes; RF Protocol: BLE 6.0 and IEEE802.15.4-2020; Core: Cortex®-M33; Flash Size: 1524 KB; RAM Size: 256 KB; RF Freq: 2.4GHz; Manufacturer: u-blox; Part Number: UBXH29-0000036; Automotive: No; ComponentLink1Description: Arena Link; ComponentLink1Url: https://app.bom.com/2K4NSGOQKM5DW9BJRRPB; Max Operating Temp: 85°C; Min Operating Temp: -40°C; Part Name: SHORT RANGE BLE AND IEEE802.15.4 SIP MODULE U-BLOX ANNA-B5; Part Status: Preferred; Part Type: Wireless Module; Volume Use: Yes; Mounting Type: SMT; Internal Antenna: Yes; Manufacturer P/N: ANNA-B5
R1 R6 R10 R18 = UBXH18-0008037: RES THICK FILM CHIP 0402 330R 5% 63mW; Manufacturer: KOA; Manufacturer P/N: RK73B1ETTP331J; Editor: daniel.hurni; Released by: doris.zahnd; Env: ROHS; Permitted Use: Volume Products; Perferred: PREF; Mfg P/N Status: Active; Mfg P/N Split: 100; Mfg P/N Released: Yes; Part Number: UBXH18-0008037; Tolerance: 5%; Max Power: 63mW; Part Type: Resistor; Release Data: 2009-12-01T17:14:36; UBX Wiki: https://wiki.u-blox.com/bin/view/Operations/PartDetails?index=6922; RefDes: R; Min Operating Temp: -55°C; Max Operating Temp: 125°C; Mfg P/N Datasheet: https://wiki.u-blox.com/bin/view/Generic/Docs/DocumentSummary?index=4543
  R1 R6: Case/Package: 0x0y
R2-R5 R7-R9 R11 R15-R17 R19 R22-R24 R27 R28 R197 = UBXH18-0003002: as R30 on sheet EVB-ANNA-B5_SCHEM_0001_Power; Part Number: UBXH18-0003002; Max Power: 100mW; Part Type: Resistor; Release Data: 2012-06-05 09:49:55.978616; UBX Wiki: https://wiki.u-blox.com/bin/view/Operations/PartDetails?index=6611; RefDes: R; Manufacturer 2: YAGEO; Manufacturer P/N 2: 2322_705_91001_L; Mfg P/N Status 2: NRND; Mfg P/N Split 2: 0; Mfg P/N Released 2: Yes
R12-R14 R20 R21 R25 R26 R36 = UBXH18-0003002: as R33 on sheet EVB-ANNA-B5_SCHEM_0001_Power; Part Number: UBXH18-0003002; Part Type: Resistor; UBX Wiki: https://wiki.u-blox.com/bin/view/Operations/PartDetails?index=6611; RefDes: R; Manufacturer 2: YAGEO; Manufacturer P/N 2: 2322_705_91001_L; Mfg P/N Split 2: 0; Mfg P/N Released 2: Yes; Max Power: 100mW
  R12-R14 R21 R26 R36: Release Data: 2012-06-05T09:49:55; Mfg P/N Status 2: Obsolete
  R20 R25: Release Data: 2012-06-05 09:49:55.978616; Mfg P/N Status 2: NRND
TP16 TP17 = TP10R: as TP1 on sheet EVB-ANNA-B5_SCHEM_0001_Power; Part Number: TP10R; Size: 1.0mm; Height: 0; DNP: DNP; Added Date: 2/1/2015; Checked By: Paul B; Checked Date: 2/5/2015
X1 = UBXH21-0008104: CRYSTAL CL=9PF EPSON FC-135 NI/SN TERMINATION 32.768KHz; Part Phase: Unreleased; Use in new designs: No; Environmental Grade: RoHS; Frequency Tolerance: 20PPM; Owner: Andreas Thiel; Volume Use: Yes; Part Number: UBXH21-0008104; Part Name: CRYSTAL CL=9PF EPSON FC-135 NI/SN TERMINATION; Automotive: No; ComponentLink1Description: Arena Link; ComponentLink1URL: https://app.bom.com/6O8RWKSUOQ9H0EE2EEBI; Frequency: 32.768KHz; Part Status: Non-Preferred; Part Type: Crystal